# EAGLE design RFID-Lock (EAGLE 7.6.0)
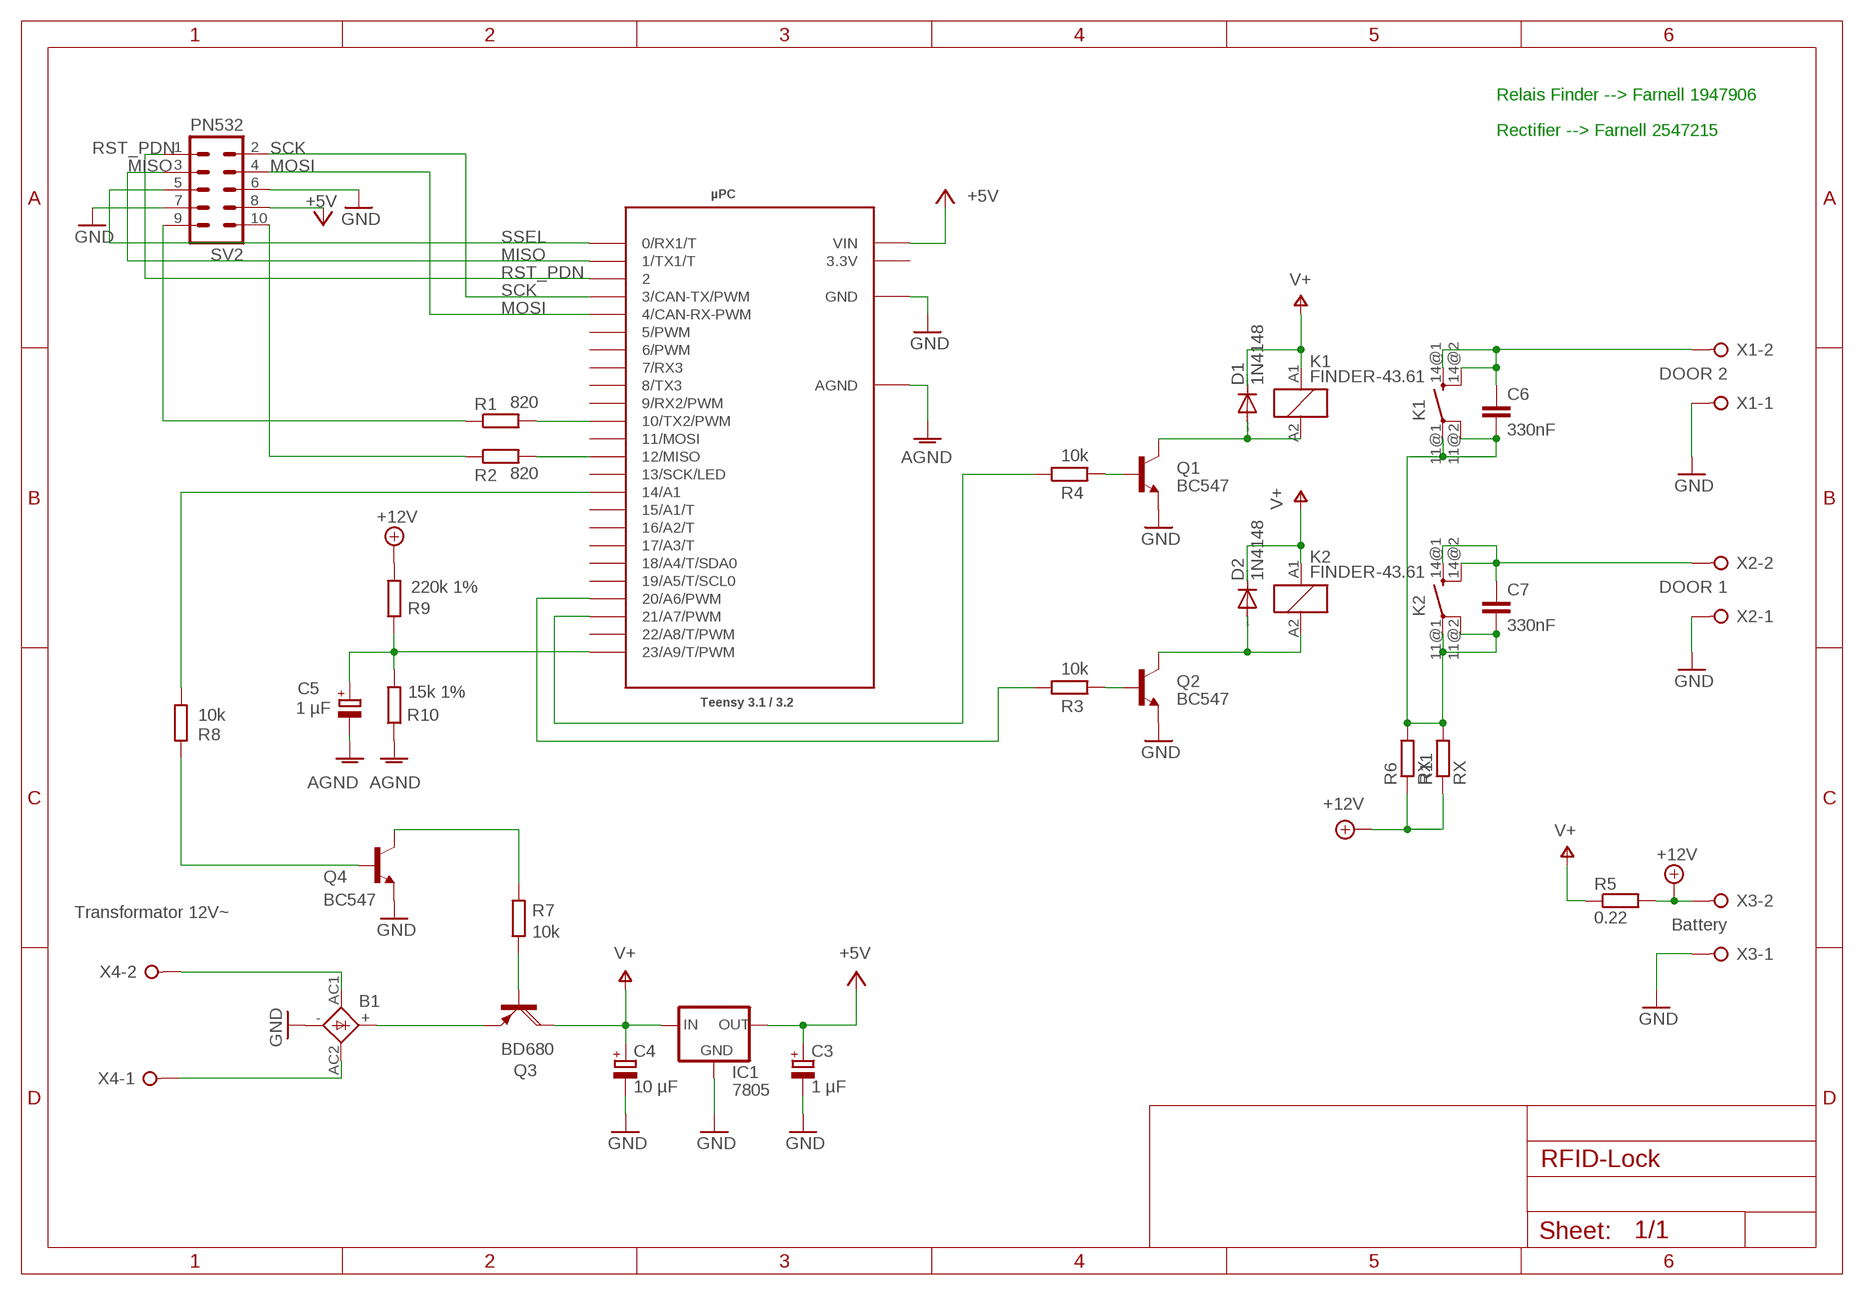
[diagram p0: schematic, sheet 1]

## Parts
B1  GBPC6  [GBPC6]
C3  1 µF  CPOL-EUE2.5-5  [E2,5-5]
C4  10 µF  CPOL-EUE2.5-5  [E2,5-5]
C5  1 µF  CPOL-EUE2.5-5  [E2,5-5]
C6  330nF  C5/4.5  [C5B4.5]
C7  330nF  C5/4.5  [C5B4.5]
D1  1N4148  1N4148DO35-7  [DO35-7]
D2  1N4148  1N4148DO35-7  [DO35-7]
IC1  7805  78XXS  [78XXS]
K1  FINDER-43.61  [FINDER-43.61]
K2  FINDER-43.61  [FINDER-43.61]
Q1  BC547  [TO92]
Q2  BC547  [TO92]
Q3  BD680  [TO126AV]
Q4  BC547  [TO92]
R1  820  R-EU_0204/7  [0204/7]
R2  820  R-EU_0204/7  [0204/7]
R3  10k  R-EU_0204/7  [0204/7]
R4  10k  R-EU_0204/7  [0204/7]
R5  0.22  R-EU_0204/7  [0204/7]
R6  RX  R-EU_0613/15  [P0613/15]
R7  10k  R-EU_0204/7  [0204/7]
R8  10k  R-EU_0204/7  [0204/7]
R9  220k 1%  R-EU_0204/7  [0204/7]
R10  15k 1%  R-EU_0204/7  [0204/7]
R11  RX  R-EU_0613/15  [P0613/15]
SV2  PN532  MA05-2  [MA05-2]
X1  DOOR 2  W237-02P  [W237-132]
X2  DOOR 1  W237-02P  [W237-132]
X3  Battery  W237-02P  [W237-132]
X4  Transformator 12V~  W237-02P  [W237-132]
µPC  Teensy 3.1 / 3.2  TEENSY_3.1_DIL  [TEENSY3-DIL]

## Nets
+5V: C3.+ IC1.OUT SV2.8 µPC.VIN
+12V: R5.2 R6.1 R9.2 R11.1 X3.2
AGND: C5.- R10.1 µPC.AGND
DOOR2: C6.1 K1.14@1(-1:SA) K1.14@2(-1:SB) X1.2
GND: B1.- C3.- C4.- IC1.GND Q1.1(E) Q2.1(E) Q4.1(E) SV2.6 SV2.7 X1.1 X2.1 X3.1 µPC.GND
LED-GREEN: R1.1 SV2.9
LED-RED: R2.1 SV2.10
MISO: SV2.3 µPC.1(1/TX1/T)
MOSI: SV2.4 µPC.4(4/CAN-RX-PWM)
N$1: Q3.B R7.1
N$2: Q4.3(C) R7.2
N$3: R1.2 µPC.10(10/TX2/PWM)
N$4: R2.2 µPC.12(12/MISO)
N$5: B1.AC1 X4.2
N$6: D2.A K2.A2 Q2.3(C)
N$7: Q4.2(B) R8.1
N$8: C7.1 K2.14@1(-1:SA) K2.14@2(-1:SB) X2.2
N$9: D1.A K1.A2 Q1.3(C)
N$10: Q1.2(B) R4.2
N$11: Q2.2(B) R3.2
N$12: R4.1 µPC.21/A7(21/A7/PWM)
N$13: R3.1 µPC.20/A6(20/A6/PWM)
N$16: B1.+ Q3.E
N$17: B1.AC2 X4.1
N$20: C6.2 C7.2 K1.11@1(-1:PA) K1.11@2(-1:PB) K2.11@1(-1:PA) K2.11@2(-1:PB) R6.2 R11.2
N$25: R8.2 µPC.14/A0(14/A1)
N$26: C5.+ R9.1 R10.2 µPC.23/A9(23/A9/T/PWM)
RST_PDN: SV2.1 µPC.2
SCK: SV2.2 µPC.3(3/CAN-TX/PWM)
SSEL: SV2.5 µPC.0(0/RX1/T)
V+: C4.+ D1.C D2.C IC1.IN K1.A1 K2.A1 Q3.C R5.1
Unconnected: µPC.5(5/PWM) µPC.6(6/PWM) µPC.7(7/RX3) µPC.8(8/TX3) µPC.9(9/RX2/PWM) µPC.11(11/MOSI) µPC.13(13/SCK/LED) µPC.15/A1(15/A1/T) µPC.16/A2(16/A2/T) µPC.17/A3(17/A3/T) µPC.18/A4(18/A4/T/SDA0) µPC.19/A5(19/A5/T/SCL0) µPC.22/A8(22/A8/T/PWM)

## Notes on the sheet
- Relais Finder --> Farnell 1947906
- Rectifier --> Farnell 2547215

## Power pins joined to a net without a drawn wire
3.3V: µPC.3.3V

## Library data of the parts
B1 = rectifier:GBPC6: GENERAL INSTRUMENT RECTIFIER
C3-C5 = rcl:CPOL-EU: POLARIZED CAPACITOR, European symbol
C6 C7 = capacitor-wima:C: CAPACITOR naming: grid - package width
D1 D2 = diode:1N4148: DIODE high speed (Philips)
IC1 = v-reg:78XXS: VOLTAGE REGULATOR
K1 K2 = relay:FINDER-43.61: Low profile PCB relays 10 - 16 A FINDER 43 Series Kontakt max. AC- 250V, Strom - Kontakt AC- max. 10A 5 mm contact pin pitch, 1 Pole NO, 16 A, PCB mount Distributor: FARNELL Source: http://www.farnell.com/datasheets/87682.pdf; OC_FARNELL: unknown; OC_NEWARK: unknown
Q1 Q2 Q4 = transistor-npn:BC547*: NPN Transistor
Q3 = transistor-power:BD680: PNP DARLINGTON TRANSISTOR
R1-R4 R7-R10 = rcl:R-EU_: RESISTOR, European symbol
R5 R6 R11 = resistor:R-EU_: RESISTOR, European symbol
SV2 = con-lstb:MA05-2: PIN HEADER; OC_FARNELL: unknown; OC_NEWARK: unknown
X1-X4 = con-wago-508:W237-02P: WAGO SREW CLAMP; OC_FARNELL: unknown; OC_NEWARK: unknown
µPC = Teensy_3_and_LC_Series_Boards_v1.1:TEENSY_3.1_DIL: Teensy 3.1 or 3.2 in a DIL Layout.

## Board
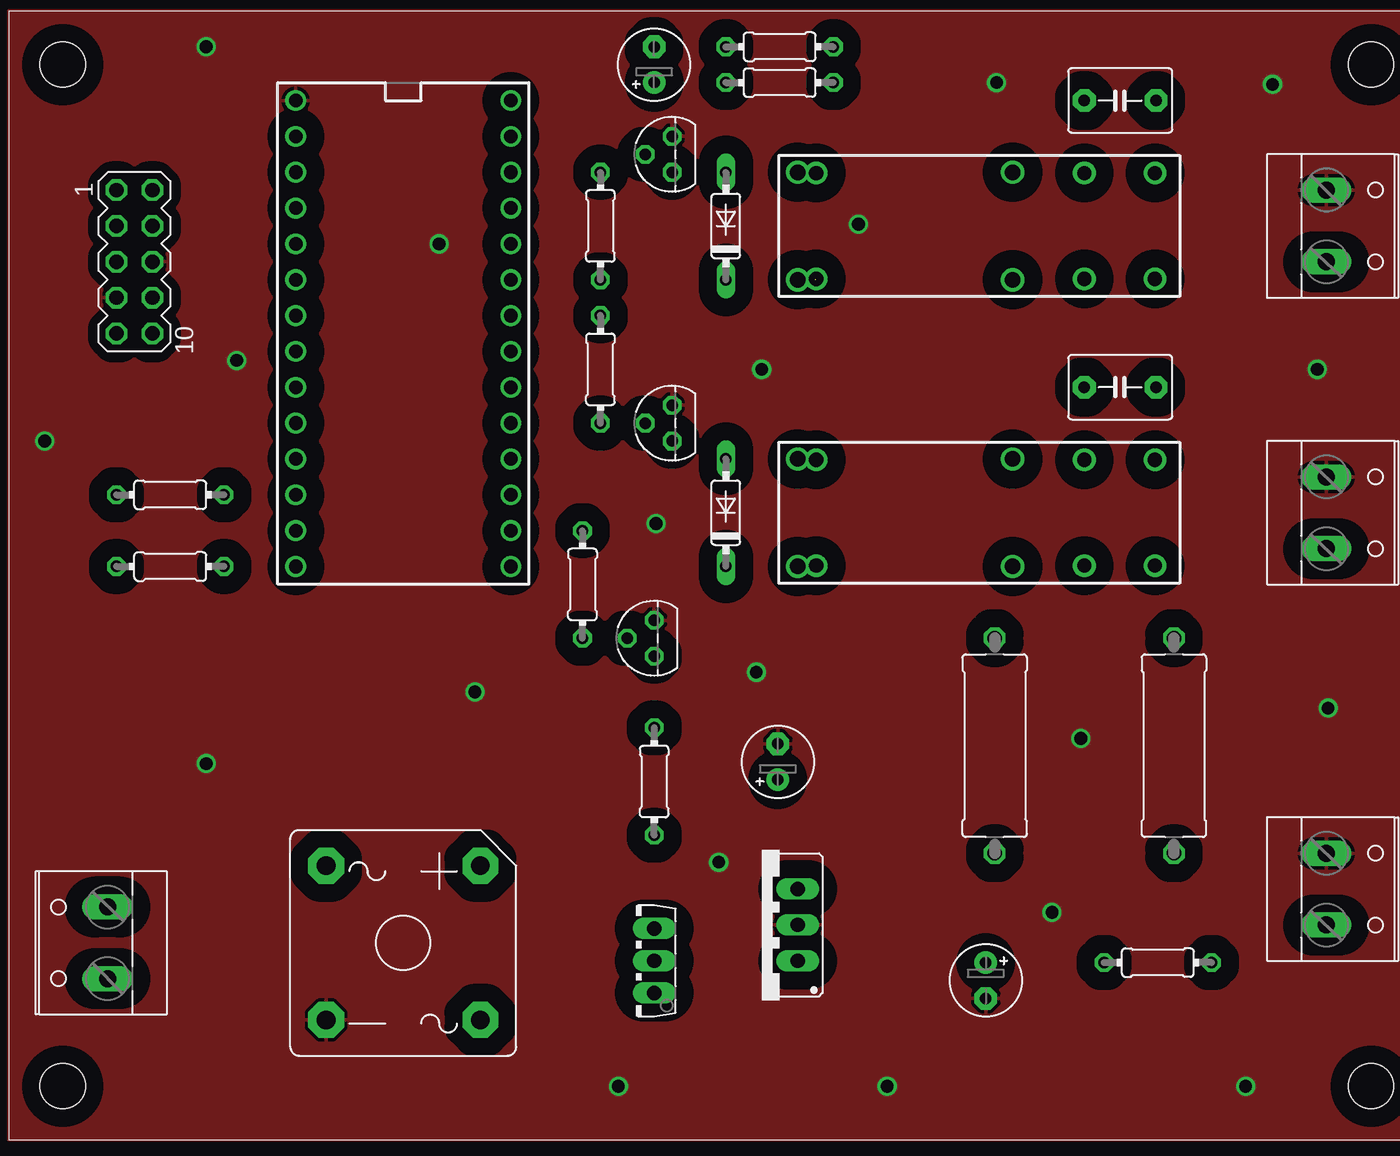
[diagram p1: board, top side]
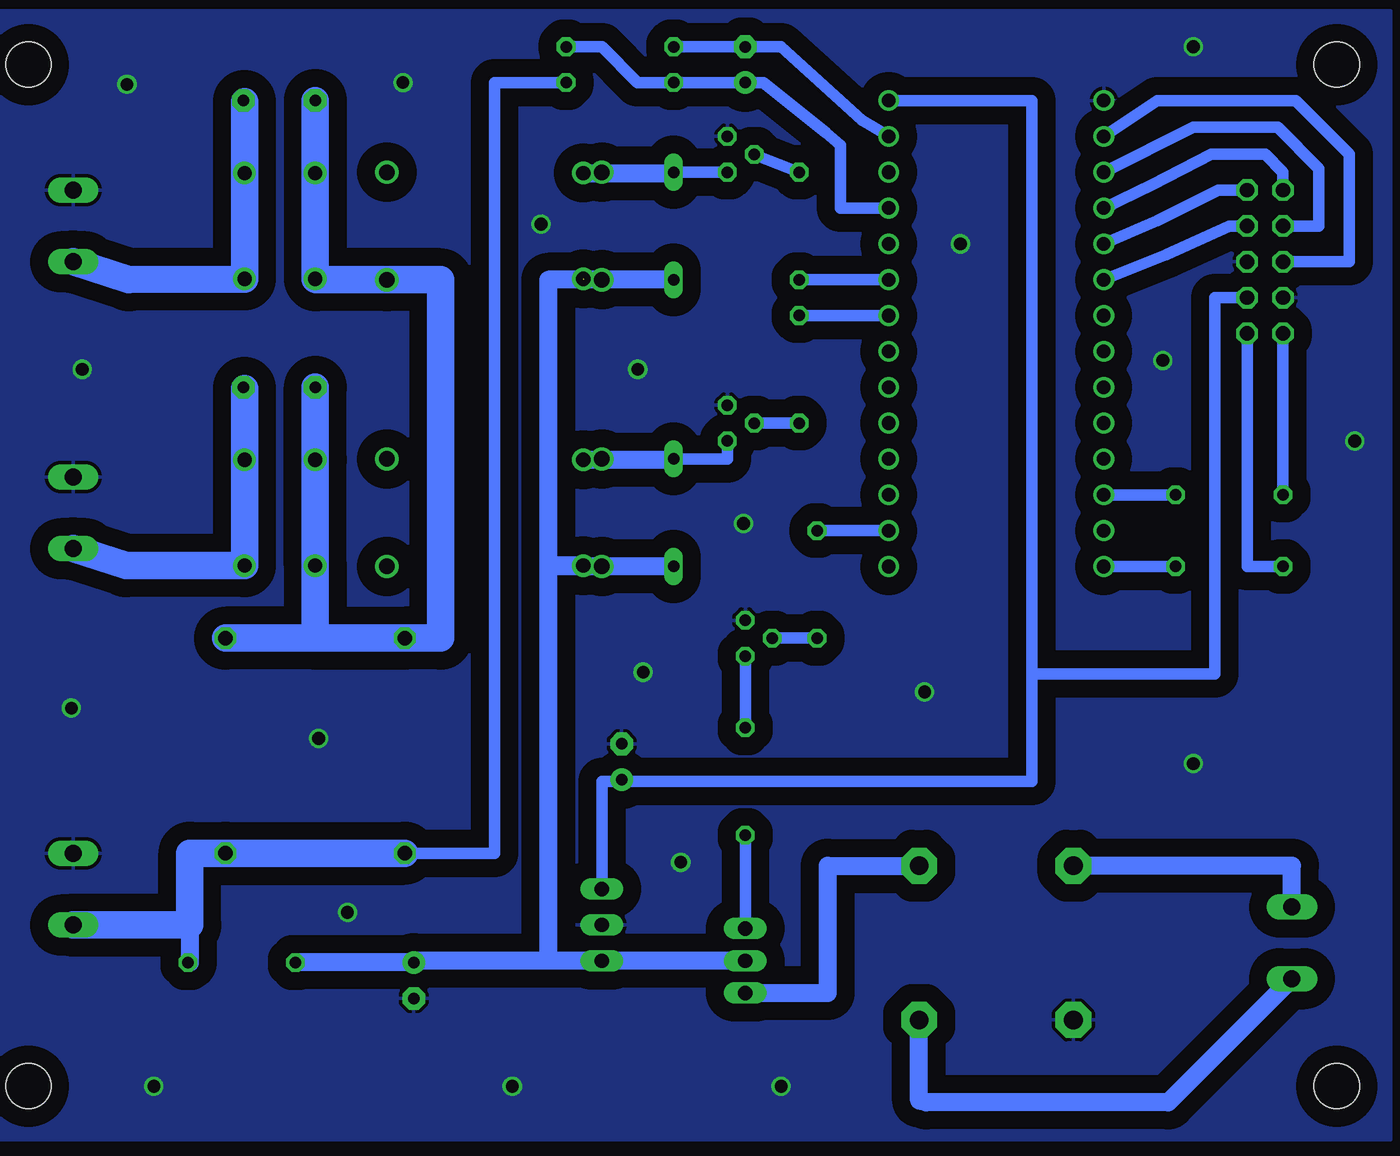
[diagram p2: board, bottom side, seen from below]

No outline drawn. Coordinates in mm, seen from the top.
Copper layers (1*16): Top 0.035mm / dielectric 1.5mm / Bottom 0.035mm
Design rules "default": minimum track width 10mil, minimum drill 24mil, track to track 8mil, track to pad 8mil, pad to pad 8mil, via to via 8mil, smd to smd 8mil, copper to edge 40mil, drill to drill 8mil, minimum pad ring 10mil, minimum via ring 8mil, stop-mask expansion 4mil, vias tented up to drill 0mil, thermal gap 10mil
Holes 3.2 mm at 3.81,3.81 96.52,3.81 96.52,76.2 3.81,76.2

### Footprints (pad centres in the part's own frame; a part is rotated, then mirrored left to right if it is on the bottom)
GBPC6 = drill 1.321 pad 2.54 octagon: + 5.461,5.461; - -5.461,-5.461; AC1 -5.461,5.461; AC2 5.461,-5.461
E2,5-5 = drill 0.813 pad 1.6: + -1.27,0 | drill 0.813 pad 1.6 octagon: - 1.27,0
C5B4.5 = drill 0.813 pad 1.6 octagon: 1 -2.54,0; 2 2.54,0
DO35-7 = drill 0.813 long: A 3.81,0; C -3.81,0
78XXS = drill 1.016 long: GND 0,-2.54; IN -2.54,-2.54; OUT 2.54,-2.54
FINDER-43.61 = drill 1 pad 1.6: 11@1 0,3.75; 11@2 0,-3.75; 14@1 5,3.75; 14@2 5,-3.75; A1 -19,-3.75; A2 -19,3.75
TO92 = drill 0.813 octagon: 1 1.27,0; 2 0,1.905; 3 -1.27,0
TO126AV = drill 1.016 long: B 2.286,-1.27; C 0,-1.27; E -2.286,-1.27
0204/7 = drill 0.813 octagon: 1 -3.81,0; 2 3.81,0
P0613/15 = drill 1.016 octagon: 1 -7.62,0; 2 7.62,0
MA05-2 = drill 1.016 octagon: 1 -5.08,-1.27; 2 -5.08,1.27; 3 -2.54,-1.27; 4 -2.54,1.27; 5 0,-1.27; 6 0,1.27; 7 2.54,-1.27; 8 2.54,1.27; 9 5.08,-1.27; 10 5.08,1.27
W237-132 = drill 1.194 long: 1 -2.54,-0.635; 2 2.54,-0.635
TEENSY3-DIL = drill 0.965: 0 -7.62,13.97; 1 -7.62,11.43; 2 -7.62,8.89; 3 -7.62,6.35; 3.3V 7.62,11.43; 4 -7.62,3.81; 5 -7.62,1.27; 6 -7.62,-1.27; 7 -7.62,-3.81; 8 -7.62,-6.35; 9 -7.62,-8.89; 10 -7.62,-11.43; 11 -7.62,-13.97; 12 -7.62,-16.51; 13 7.62,-16.51; 14/A0 7.62,-13.97; 15/A1 7.62,-11.43; 16/A2 7.62,-8.89; 17/A3 7.62,-6.35; 18/A4 7.62,-3.81; 19/A5 7.62,-1.27; 20/A6 7.62,1.27; 21/A7 7.62,3.81; 22/A8 7.62,6.35; 23/A9 7.62,8.89; AGND 7.62,13.97; GND -7.62,16.51; VIN 7.62,16.51

### Placement (x,y rotation side)
B1  27.94,13.97 0 top
C3  54.48,26.8 90 top
C4  69.22,11.3 270 top
C5  45.72,76.2 90 top
C6  78.74,73.66 180 top
C7  78.74,53.34 180 top
D1  50.8,64.77 90 top
D2  50.8,44.45 90 top
IC1  53.34,15.24 90 top
K1  76.2,64.77 0 top
K2  76.2,44.45 0 top
Q1  46.99,69.85 90 top
Q2  46.99,50.8 90 top
Q3  44.45,12.7 90 top
Q4  45.72,35.56 90 top
R1  11.43,45.72 0 top
R2  11.43,40.64 0 top
R3  41.91,54.61 270 top
R4  41.91,64.77 90 top
R5  81.41,12.57 0 top
R6  82.55,27.94 90 top
R7  45.72,25.4 90 top
R8  40.64,39.37 90 top
R9  54.61,74.93 0 top
R10  54.61,77.47 0 top
R11  69.85,27.94 90 top
SV2  8.89,62.23 270 top
X1  93.98,64.77 270 top
X2  93.98,44.45 270 top
X3  93.98,17.78 270 top
X4  6.35,13.97 90 top
µPC  27.94,57.15 0 top

### Tracks (layer width: path | path; a pad name or v marks a point on that pad's centre or on a via)
+5V
  Bottom 0.813: SV2.8 12.45,59.69 12.45,33.02 25.4,33.02 | µPC.VIN 25.4,73.66 25.4,33.02 | 54.61,25.4 25.4,25.4 25.4,33.02 | C3.+ 54.61,25.4 | 54.61,25.4 55.88,25.4 IC1.OUT
+12V
  Bottom 0.813: R9.2 63.5,74.93 63.5,20.32 R11.1
  Bottom 1.27: 92.71,15.24 X3.2 | 85.09,15.24 85.09,12.57 R5.2
  Bottom 1.93: X3.2 85.09,15.24 85.09,20.32 R6.1 R11.1
AGND
  Bottom 0.813: R10.1 C5.- 43.18,77.47 37.47,72.26 µPC.AGND
DOOR2
  Bottom 1.27: 81.2,73.58 C6.1 | K1.14@2 81.22,61.02
  Bottom 1.93: K1.14@2 K1.14@1 81.2,73.58 | 81.22,61.02 89.41,60.96 X1.2
GND  (via drill 0.9)
  other vias: 13.97,26.67 2.54,49.53 16.13,55.24 43.18,3.81 62.23,3.81 89.53,74.8 92.71,54.61 87.63,3.81 75.95,28.45 93.47,30.61 45.85,43.69 73.91,16.13 13.97,77.47 30.48,63.5 69.98,74.93 50.29,19.68 60.2,64.9 33.02,31.75 52.96,33.15 53.34,54.61
  pour Bottom (isolate 1.27): 0,80.01 99.69,80.01 99.69,0 0,0
  pour Top (isolate 1.27): 0,80.01 99.69,80.01 99.69,0 0,0
LED-GREEN
  Bottom 0.813: SV2.9 R1.1
LED-RED
  Bottom 0.813: R2.1 10.16,40.64 SV2.10
MISO
  Bottom 0.813: µPC.1 13.97,71.75 8,71.75 5.08,68.83 5.08,64.77 SV2.3
MOSI
  Bottom 0.813: µPC.4 15.88,62.74 11.43,64.77 SV2.4
N$1
  Bottom 0.813: Q3.B R7.1
N$2
  Bottom 0.813: R7.2 Q4.3
N$3
  Bottom 0.813: µPC.10 R1.2
N$4
  Bottom 0.813: R2.2 µPC.12
N$5
  Bottom 1.27: X4.2 6.99,19.43 B1.AC1
N$6
  Bottom 0.813: D2.A 46.99,48.26 Q2.3
  Bottom 1.27: K2.A2 50.86,48.2 D2.A
N$7
  Bottom 0.813: R8.1 Q4.2
N$8
  Bottom 1.27: 81.2,53.26 C7.1
  Bottom 1.93: 81.2,53.26 K2.14@1 K2.14@2 89.59,40.7 X2.2
N$9
  Bottom 0.813: D1.A Q1.3
  Bottom 1.27: K1.A2 50.86,68.52 D1.A
N$10
  Bottom 0.813: Q1.2 44.83,69.72 R4.2
N$11
  Bottom 0.813: R3.2 Q2.2
N$12
  Bottom 0.813: R4.1 µPC.21/A7
N$13
  Bottom 0.813: R3.1 µPC.20/A6
N$14  (via drill 1.1)
  other vias: 71.12,48.26
N$15  (via drill 1.1)
  other vias: 71.12,40.64
N$16
  Bottom 1.27: Q3.E 39.88,10.41 39.88,19.43 B1.+
N$17
  Bottom 1.27: X4.1 15.75,2.67 32.89,2.67 33.4,2.79 B1.AC2
N$18  (via drill 1.1)
  other vias: 71.12,68.58
N$19  (via drill 1.1)
  other vias: 55.88,68.58
N$20  (via drill 1.1)
  Bottom 1.93: C7.2 K2.11@1 K2.11@2 76.2,35.56 | C6.2 K1.11@1 K1.11@2 76.14,60.96 v71.12,60.96 67.31,60.96 67.31,35.56 R11.2 76.2,35.56 | 76.2,35.56 R6.2
N$21  (via drill 1.1)
  other vias: 55.88,60.96
N$22  (via drill 1.1)
  other vias: 55.88,48.26
N$25
  Bottom 0.813: R8.2 µPC.14/A0
N$26
  Bottom 0.813: R10.2 55.88,77.47 53.34,74.93 R9.1 C5.+ 44.45,74.93 40.01,71.37 38.99,70.48 38.99,66.04 µPC.23/A9
RST_PDN
  Bottom 0.813: µPC.2 16.89,67.69 12.7,69.85 8.89,69.85 7.62,68.58 SV2.1
SCK
  Bottom 0.813: µPC.3 16.51,65.15 12.19,67.31 SV2.2
SSEL
  Bottom 0.813: SV2.5 2.92,62.23 2.92,69.85 6.73,73.66 16.51,73.66 µPC.0
V+  (via drill 1.1)  (1 unrouted)
  Bottom 0.813: 69.09,12.7 C4.+
  Bottom 1.27: K1.A1 50.86,61.02 D1.C | 57.14,40.64 K2.A1 59.69,40.7 | 57.15,60.96 59.69,60.96 59.69,40.7 | 59.69,12.7 69.09,12.7 | C4.+ R5.1 | Q3.C IC1.IN 59.69,12.7 | 59.69,40.64 59.69,12.7 | D2.C v55.88,40.64 59.69,40.64 | 59.69,40.7 59.69,40.64

### Text on the board
tValues: - | +